# EAGLE schematic Comparator (EAGLE 7.2.0)
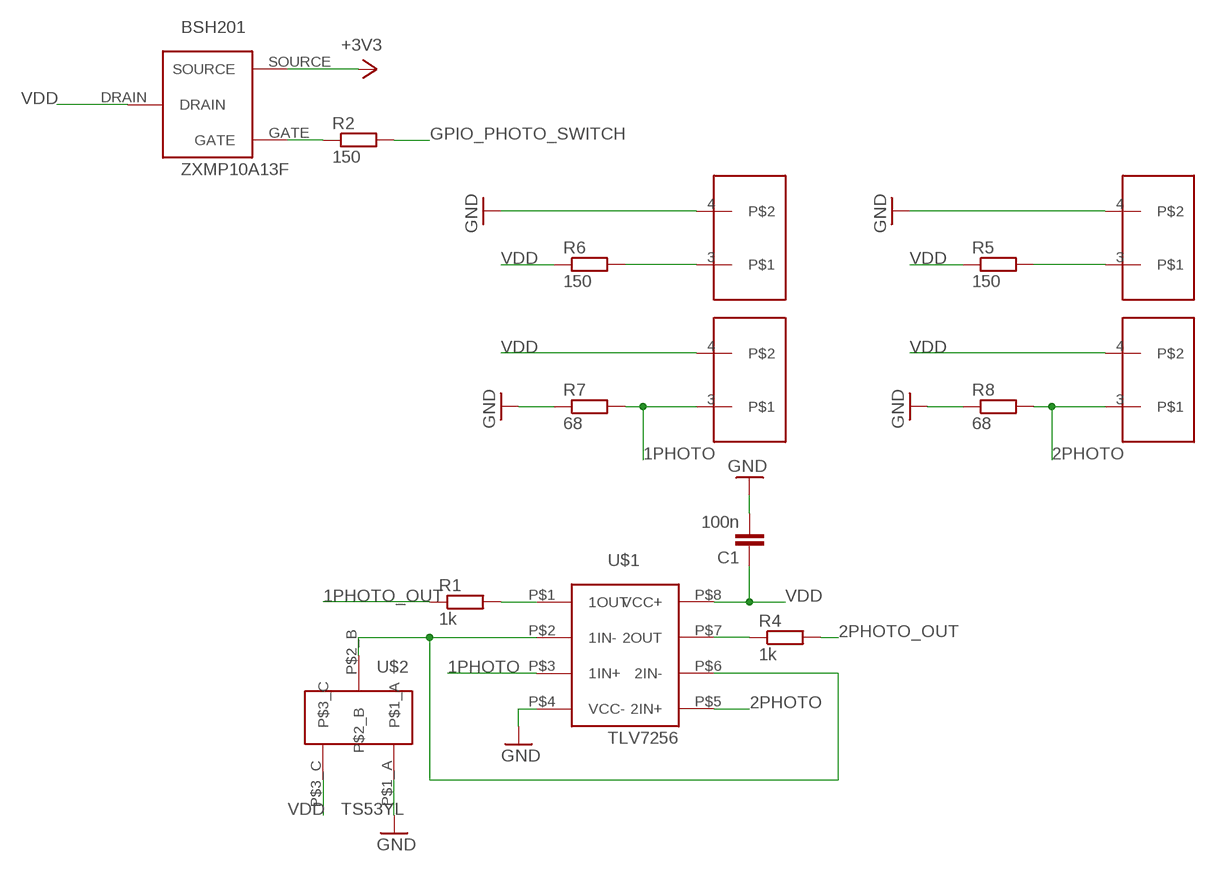
[diagram p0: schematic, sheet 1]

## Parts
BSH201  ZXMP10A13F  [P-CHANNEL]
C1  100n  C-EUC0805  [C0805]
R1  1k  R-EU_R0805  [R0805]
R2  150  R-EU_R0805  [R0805]
R4  1k  R-EU_R0805  [R0805]
R5  150  R-EU_R0805  [R0805]
R6  150  R-EU_R0805  [R0805]
R7  68  R-EU_R0805  [R0805]
R8  68  R-EU_R0805  [R0805]
SKRUVPLINT_2P1  SKRUVPLINT_2P  [SKRUVPLINT_2P]
SKRUVPLINT_2P2  SKRUVPLINT_2P  [SKRUVPLINT_2P]
SKRUVPLINT_2P3  SKRUVPLINT_2P  [SKRUVPLINT_2P]
SKRUVPLINT_2P4  SKRUVPLINT_2P  [SKRUVPLINT_2P]
U$1  TLV7256  [VSSOP]
U$2  TS53YL  [POT]

## Nets
1PHOTO: R7.2 SKRUVPLINT_2P2.3 U$1.P$3(1IN+)
1PHOTO_OUT: R1.1
2PHOTO: R8.2 SKRUVPLINT_2P4.3 U$1.P$5(2IN+)
2PHOTO_OUT: R4.2
+3V3: BSH201.SOURCE
GND: C1.2 R7.1 R8.1 SKRUVPLINT_2P1.4 SKRUVPLINT_2P3.4 U$1.P$4(VCC-) U$2.P$1_A
GPIO_PHOTO_SWITCH: R2.2
N$1: U$1.P$2(1IN-) U$1.P$6(2IN-) U$2.P$2_B
N$2: R1.2 U$1.P$1(1OUT)
N$4: R4.1 U$1.P$7(2OUT)
N$5: R5.2 SKRUVPLINT_2P3.3
N$6: R6.2 SKRUVPLINT_2P1.3
N$7: BSH201.GATE R2.1
VDD: BSH201.DRAIN C1.1 R5.1 R6.1 SKRUVPLINT_2P2.4 SKRUVPLINT_2P4.4 U$1.P$8(VCC+) U$2.P$3_C

## Library data of the parts
BSH201 = ZXMP10A13F:ZXMP10A13F
C1 = rcl:C-EU: CAPACITOR, European symbol
R1 R2 R4-R8 = rcl:R-EU_: RESISTOR, European symbol
SKRUVPLINT_2P1-SKRUVPLINT_2P4 = skruvplint2p_CTB0700:SKRUVPLINT_2P
U$1 = TLV7256:TLV7256
U$2 = TS53YL:TS53YL